# Altium schematic sheet Displays.SchDoc
size 420 x 297 mm; Address1: Address1; Address2: Address2; Address3: Address3; Address4: Address4; DocumentNumber: МЭИ.466219.001 Э3; SheetNumber: 3; Scale: 1:1; DocumentType: Схема электрическая принципиальная; FirstReferrence: АБВГ.123456.001
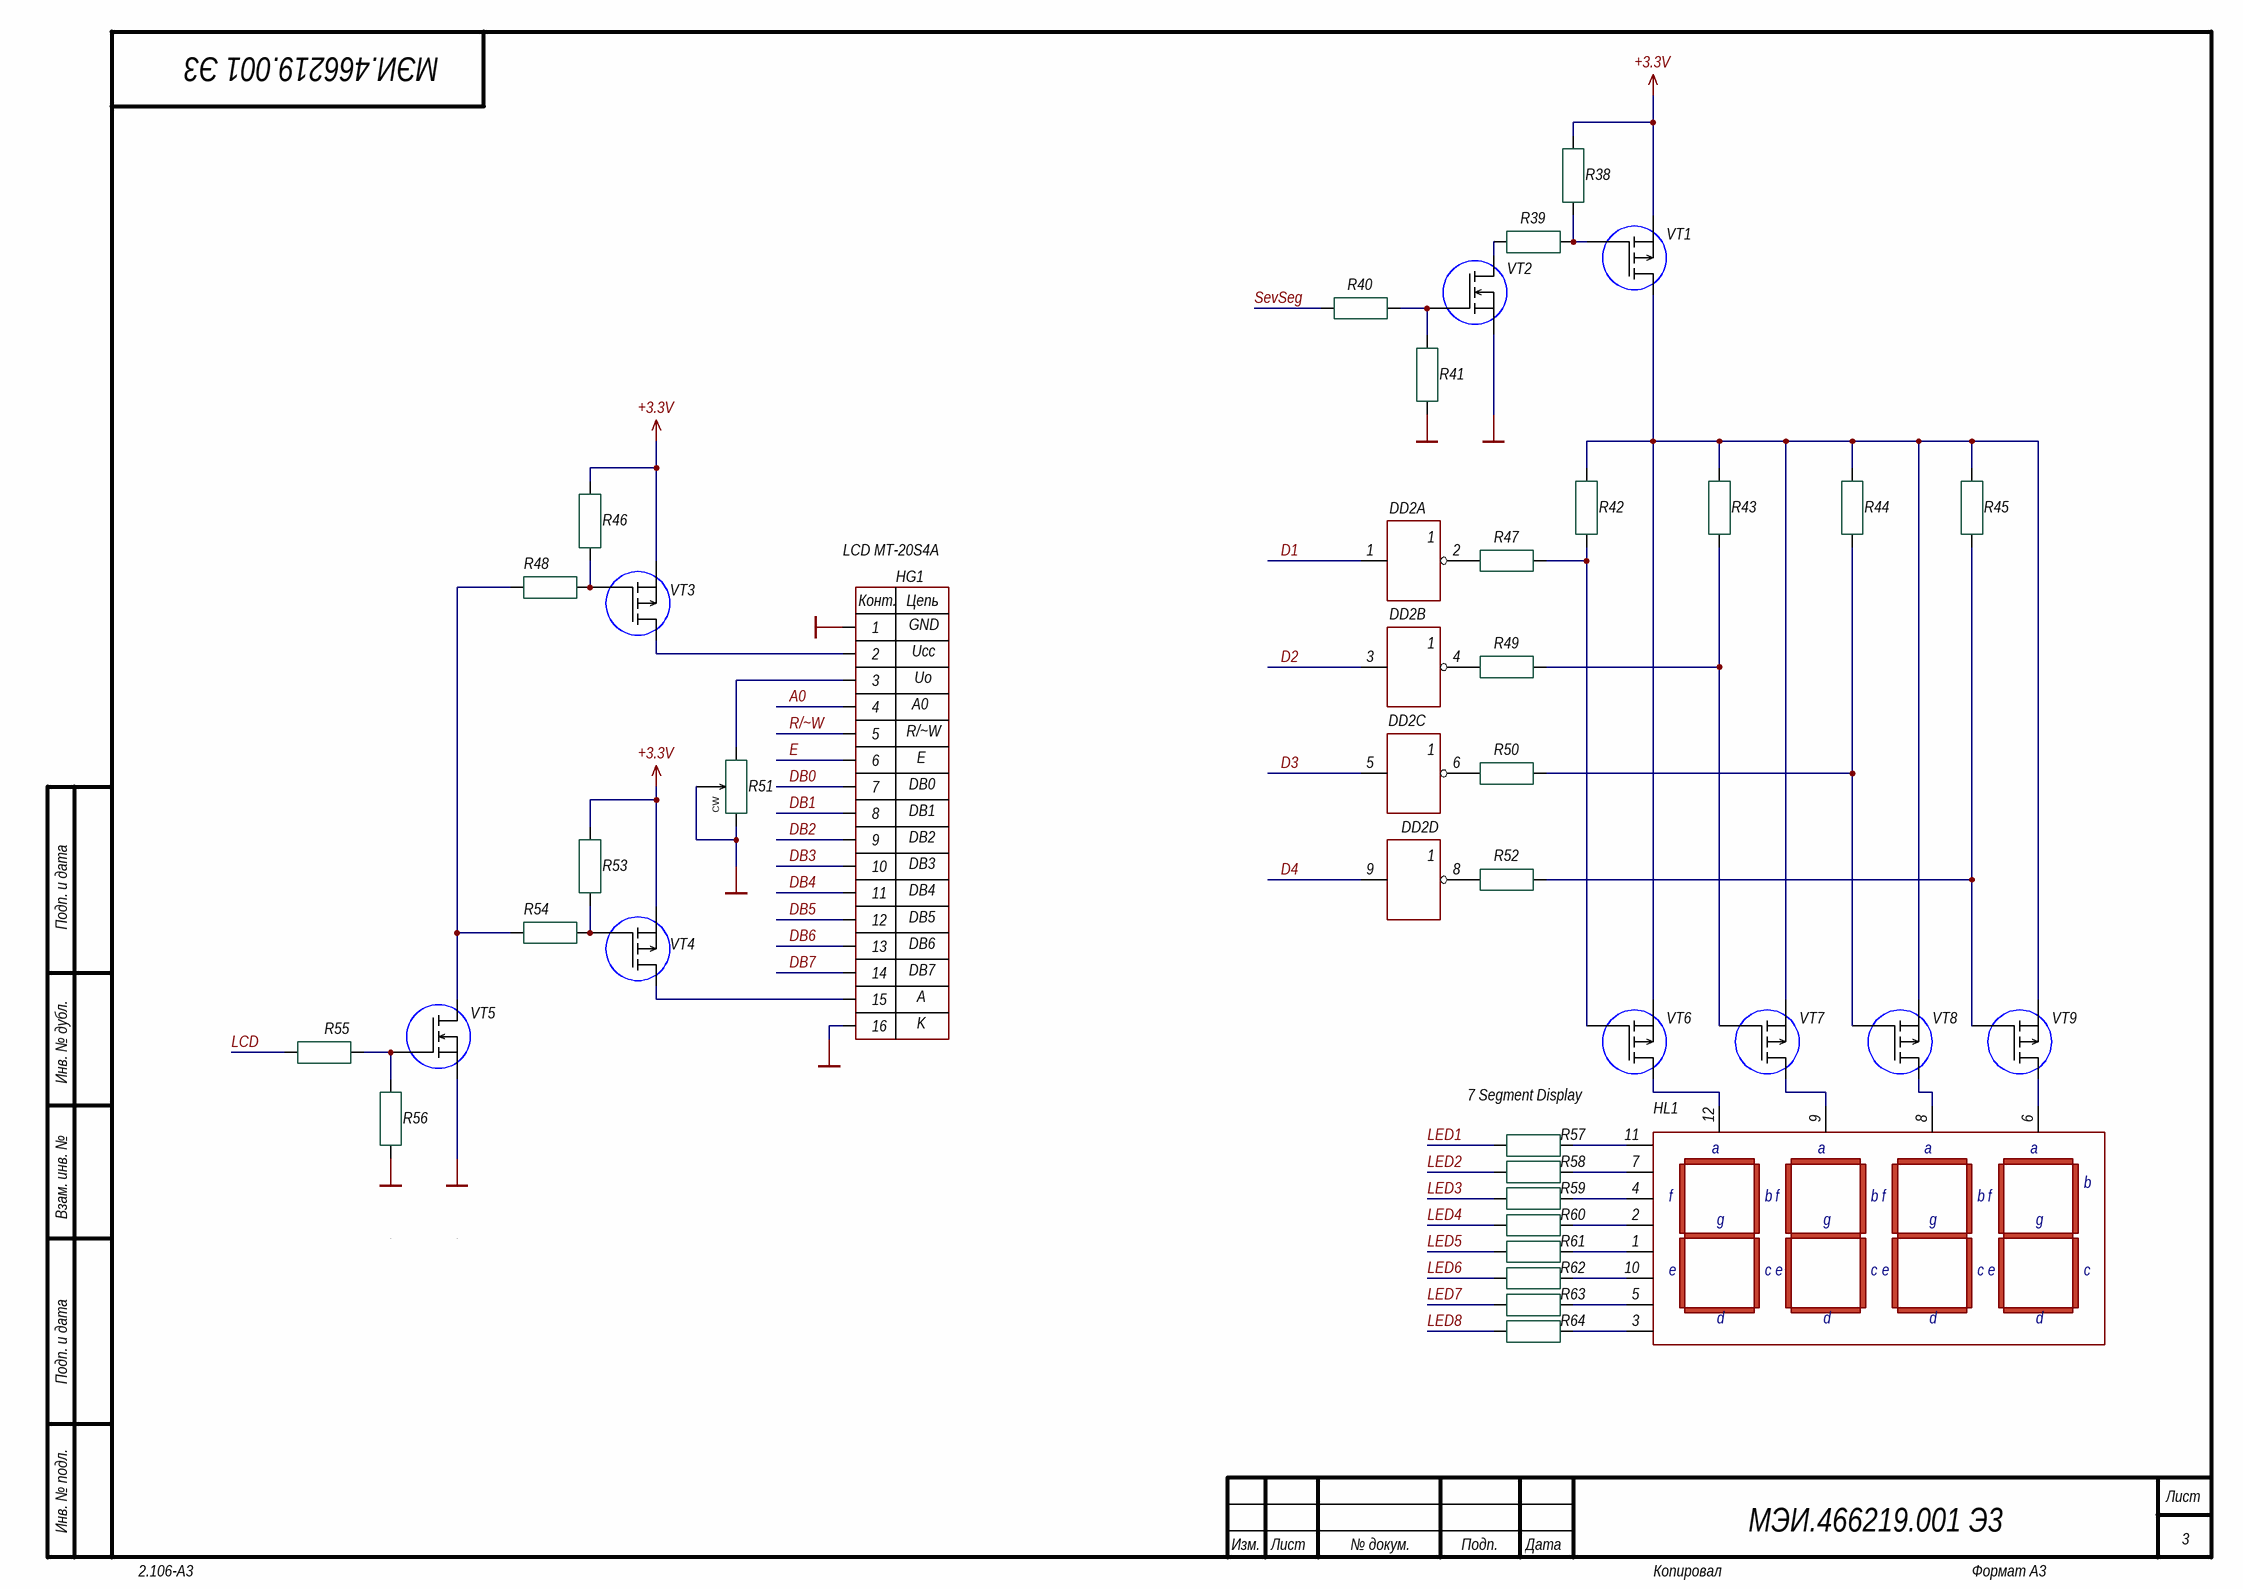
[diagram p0: Displays.SchDoc]

## Parts
DD2  SN74AHCU04DR  [SOIC127P780X200-14N]  (value not drawn)  (parts A,B,C,D of 7)
HG1  MT-20S4A-2YLG-3V0  [MT-20S4A]  (value not drawn)
HL1  CA56-12GWA  [CA56-12GWA]  (value not drawn)
R38  Thick Film  [RESC1608X55N]  (value not drawn)
R39  Thick Film  [RESC1608X55N]  (value not drawn)
R40  Thick Film  [RESC1608X55N]  (value not drawn)
R41  Thick Film  [RESC1608X55N]  (value not drawn)
R42  Thick Film  [RESC1608X55N]  (value not drawn)
R43  Thick Film  [RESC1608X55N]  (value not drawn)
R44  Thick Film  [RESC1608X55N]  (value not drawn)
R45  Thick Film  [RESC1608X55N]  (value not drawn)
R46  Thick Film  [RESC1608X55N]  (value not drawn)
R47  Thick Film  [RESC1608X55N]  (value not drawn)
R48  Thick Film  [RESC1608X55N]  (value not drawn)
R49  Thick Film  [RESC1608X55N]  (value not drawn)
R50  Thick Film  [RESC1608X55N]  (value not drawn)
R51  25 turns  [TrimPot_LCD]  (value not drawn)
R52  Thick Film  [RESC1608X55N]  (value not drawn)
R53  Thick Film  [RESC1608X55N]  (value not drawn)
R54  Thick Film  [RESC1608X55N]  (value not drawn)
R55  Thick Film  [RESC1608X55N]  (value not drawn)
R56  Thick Film  [RESC1608X55N]  (value not drawn)
R57  Thick Film  [RESC1608X55N]  (value not drawn)
R58  Thick Film  [RESC1608X55N]  (value not drawn)
R59  Thick Film  [RESC1608X55N]  (value not drawn)
R60  Thick Film  [RESC1608X55N]  (value not drawn)
R61  Thick Film  [RESC1608X55N]  (value not drawn)
R62  Thick Film  [RESC1608X55N]  (value not drawn)
R63  Thick Film  [RESC1608X55N]  (value not drawn)
R64  Thick Film  [RESC1608X55N]  (value not drawn)
VT1  IRLML2244  [SOT23-3-no_check]  (value not drawn)
VT2  IRLML6244  [SOT23-3-no_check]  (value not drawn)
VT3  IRLML2244  [SOT23-3-no_check]  (value not drawn)
VT4  IRLML2244  [SOT23-3-no_check]  (value not drawn)
VT5  IRLML6244  [SOT23-3-no_check]  (value not drawn)
VT6  IRLML2244  [SOT23-3-no_check]  (value not drawn)
VT7  IRLML2244  [SOT23-3-no_check]  (value not drawn)
VT8  IRLML2244  [SOT23-3-no_check]  (value not drawn)
VT9  IRLML2244  [SOT23-3-no_check]  (value not drawn)
X13  PBS-16R  [PBS16]  (value not drawn)
X14  PBS-16R  [PBS16]  (value not drawn)

## Nets
+3.3V: R38.2 R46.2 R53.2 VT1.2(S) VT3.2(S) VT4.2(S)
GND: HG1.1 HG1.16 R41.1 R51.CW R51.W R56.1 VT2.2(S) VT5.2(S)
A0: HG1.4
D1: DD2.1(1A)
D2: DD2.3(2A)
D3: DD2.5(3A)
D4: DD2.9(4A)
DB0: HG1.7
DB1: HG1.8
DB2: HG1.9
DB3: HG1.10
DB4: HG1.11
DB5: HG1.12
DB6: HG1.13
DB7: HG1.14
E: HG1.6
LCD: R55.1
LED1: R57.1
LED2: R58.1
LED3: R59.1
LED4: R60.1
LED5: R61.1
LED6: R62.1
LED7: R63.1
LED8: R64.1
R/~W: HG1.5
SevSeg: R40.1
NetDD2_2: DD2.2(1Y) R47.1
NetDD2_4: DD2.4(2Y) R49.1
NetDD2_6: DD2.6(3Y) R50.1
NetDD2_8: DD2.8(4Y) R52.1
NetHG1_2: HG1.2 VT3.3(D)
NetHG1_3: HG1.3 R51.CCW
NetHG1_15: HG1.15 VT4.3(D)
NetHL1_1: HL1.1(e) R61.2
NetHL1_2: HL1.2(d) R60.2
NetHL1_3: HL1.3(DP) R64.2
NetHL1_4: HL1.4(c) R59.2
NetHL1_5: HL1.5(g) R63.2
NetHL1_6: HL1.6(Dig4) VT9.3(D)
NetHL1_7: HL1.7(b) R58.2
NetHL1_8: HL1.8(Dig3) VT8.3(D)
NetHL1_9: HL1.9(Dig2) VT7.3(D)
NetHL1_10: HL1.10(f) R62.2
NetHL1_11: HL1.11(a) R57.2
NetHL1_12: HL1.12(Dig1) VT6.3(D)
NetR38_1: R38.1 R39.2 VT1.1(G)
NetR39_1: R39.1 VT2.3(D)
NetR40_2: R40.2 R41.2 VT2.1(G)
NetR42_1: R42.1 R47.2 VT6.1(G)
NetR42_2: R42.2 R43.2 R44.2 R45.2 VT1.3(D) VT6.2(S) VT7.2(S) VT8.2(S) VT9.2(S)
NetR43_1: R43.1 R49.2 VT7.1(G)
NetR44_1: R44.1 R50.2 VT8.1(G)
NetR45_1: R45.1 R52.2 VT9.1(G)
NetR46_1: R46.1 R48.2 VT3.1(G)
NetR48_1: R48.1 R54.1 VT5.3(D)
NetR53_1: R53.1 R54.2 VT4.1(G)
NetR55_2: R55.2 R56.2 VT5.1(G)

Not connected (* = marked no-connect by the designer): X13 1(VCC); X14 1(VCC)

## Notes on the sheet
- LCD MT-20S4A
- (near VT6) 7 Segment Display
- Подп. и дата
- Инв. № дубл.
- Взам. инв. №
- Инв. № подл.
- Изм.
- Лист
- № докум.
- Подп.
- Дата
- 2.106-A3
- Копировал
- Формат А3
- (in symbol MT-20S4A-2YLG-3V0) Конт.; Цепь; GND; Ucc; Uo; A0; R/~W; E; DB0; DB1; DB2; DB3; DB4; DB5; DB6; DB7; A; K

## Library data of the parts
DD2 = SN74AHCU04: HEX invertor; Manufacture: TI; HelpURL: https://www.compel.ru/infosheet/TI/SN74AHCU04D; Case: SO-14 (NS); Model: SN74AHCU04DR
HG1 = MT-20S4A-2YLG-3V0: LCD; Manufacture: МЭЛТ; HelpURL: http://www.melt.com.ru/docs/MT-20S4A.pdf; Case: *; Model: MT-20S4A-2YLG-3V0
HL1 = CA56-12GWA: Indicator; Manufacture: Kingbright; SYMBOL: 14.2mm; HelpURL: https://www.compel.ru/item-pdf/cf29282fff28ab60477c19c159e754de/pn/kgb~ca56-12gwa.pdf; Model: CA56-12GWA
R38 R41-R46 R53 R56 = RES_10K_0603_1%: Resistor SMD chip 10k Ohm 0.1W 1% 0603; Manufacturer 1: Yageo; Manufacturer Part Number 1: RC0603FR-0710KL; Ratings: 1/10W; SCDType: spec; ComponentLink1Designator: Compel; Package / Case: 0603 (1608 Metric); Supplier 1: Compel; Supplier Part Number 1: 311-10.0KHRCT-ND; Tolerance: ±1%; Value: 10K; ComponentLink1URL: https://www.compel.ru/infosheet/YAG/RC0603FR-0710KL
R39 R40 R47-R50 R52 R54 R55 = RES_470R_0603_5%: Resistor SMD chip 470 Ohm 0.1W 5% 0603; Manufacturer 1: Yageo; Manufacturer Part Number 1: CRCW0603470RJNEA; Ratings: 1/10 W; SCDType: spec; Value: 470R; ComponentLink1Designator: Compel; Package / Case: 0603 (1608 metric); Tolerance: ±5%; Material: Thick Film; Supplier 1: Compel; Supplier Part Number 1: 541-470GCT-ND; ComponentLink1URL: https://www.compel.ru/infosheet/YAG/RC0603FR-07470RL
R51 = RES_TRIMMER_10K_LCD: Trimmer THD 10K 500mW 25-turn; Manufacturer 1: Bourns; Manufacturer Part Number 1: 3266W-1-103; Tolerance: ±10%; Ratings: 250mW; ±100ppm/°C; ComponentLink1Designator: Compel; Material: *; Package / Case: 6.35×4.31×6.85; Supplier 1: Compel; Supplier Part Number 1: *; SCDType: *; ComponentLink1URL: https://www.compel.ru/infosheet/BOURNS/3266W-1-103; Value: 10K
R57-R64 = RES_68R_0603_5%: Resistor SMD chip 68 Ohm 0.1W 5% 0603; Manufacturer 1: Yageo; Manufacturer Part Number 1: RC0603FR-0768RL; Ratings: 1/10 W; Tolerance: ±1%; SCDType: spec; Value: 68R; ComponentLink1Designator: Compel; Package / Case: 0603 (1608 metric); Material: Thick Film; Supplier 1: Compel; Supplier Part Number 1: 311-68GRCT-ND; ComponentLink1URL: https://www.compel.ru/infosheet/YAG/RC0603FR-0768RL
VT1 VT3 VT4 VT6-VT9 = MOSFET_P-CH_IRLML2244TRPbF: MOSFET P-Channel SMD; Manufacturer 1: Infineon; Ratings: 20V; 4.3A; SCDType: undef; Package / Case: SOT-23-3; Supplier 1: Compel; Supplier Part Number 1: IRLML2244TRPbF; ComponentLink1URL: https://www.compel.ru/item-pdf/b67edcdbc583bffdc43763720a97c5ae/ps/infin~irlml2246pbf.pdf; ComponentLink1Description: Data; ComponentLink2Description: Compel; ComponentLink2URL: https://www.compel.ru/infosheet/INFIN/IRLML2246TRPBF; Manufacturer Part Number 1: IRLML2244TRPbF
VT2 VT5 = MOSFET_N-CH_IRLML6244TRPBF: MOSFET N-Channel SMD; Manufacturer 1: Infineon; Ratings: 20V; 6.3A; SCDType: undef; Package / Case: SOT-23-3; Supplier 1: Compel; Supplier Part Number 1: IRLML6244TRPBF; ComponentLink1URL: https://www.compel.ru/item-pdf/c888608b045c7f9cf47a03db2a6506b1/ps/infin~irlml6244pbf.pdf; ComponentLink1Description: Data; ComponentLink2Description: Compel; ComponentLink2URL: https://www.compel.ru/infosheet/INFIN/IRLML6244TRPBF; Manufacturer Part Number 1: IRLML6244TRPBF
X13 X14 = CONN LCD: Manufacture: CONNFLY; ComponentLink1Designator: Compel; ComponentLink1URL: https://www.compel.ru/infosheet/CONNFLY/PBS-16R; Model: PBS-16R